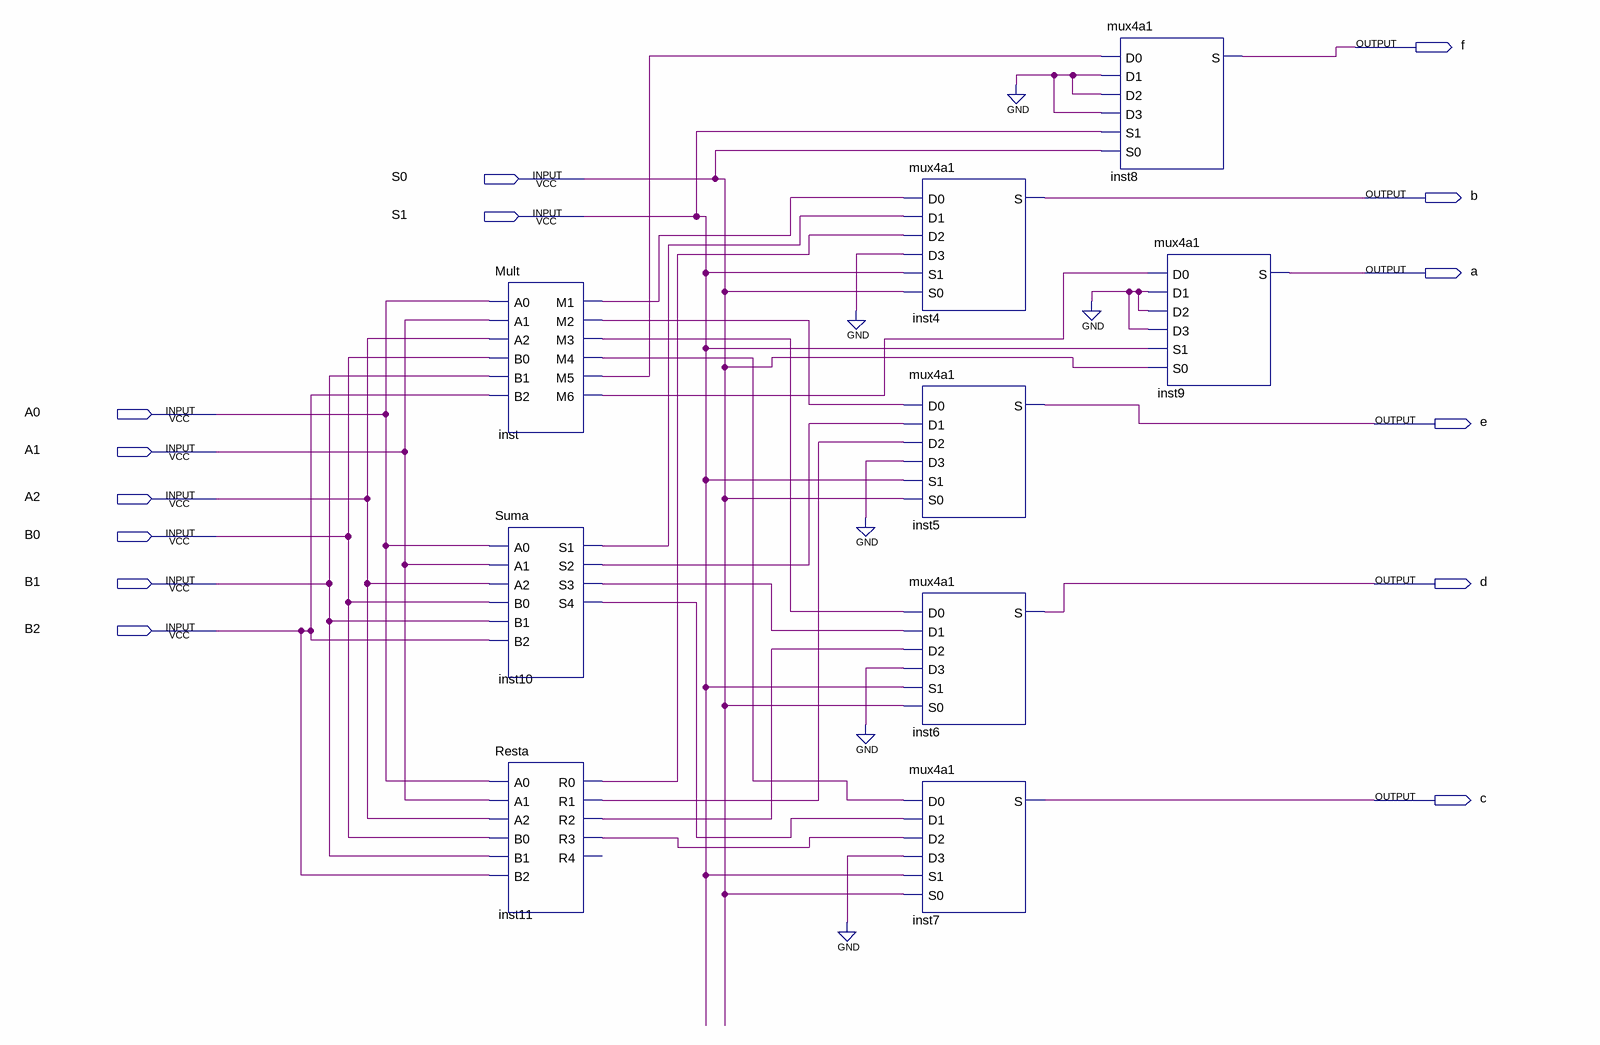
[diagram p0: schematic sheet]
// Quartus schematic Calculadora.bdf as structural Verilog: 9 symbols, 14 pins
module Calculadora (
  input  S0,
  input  S1,
  input  A0,
  input  A1,
  input  A2,
  input  B0,
  input  B1,
  input  B2,
  output f,
  output b,
  output a,
  output e,
  output d,
  output c
);

  wire inst10_s1, inst10_s2, inst10_s3, inst10_s4, inst11_r0, inst11_r1, inst11_r2, inst11_r3, inst_m1,
       inst_m2, inst_m3, inst_m4, inst_m5, inst_m6;

  Mult inst (
    .A0(A0), .A1(A1), .A2(A2), .B0(B0), .B1(B1), .B2(B2), .M1(inst_m1), .M2(inst_m2), .M3(inst_m3),
    .M4(inst_m4), .M5(inst_m5), .M6(inst_m6));
  Suma inst10 (
    .A0(A0), .A1(A1), .A2(A2), .B0(B0), .B1(B1), .B2(B2), .S1(inst10_s1), .S2(inst10_s2), .S3(inst10_s3),
    .S4(inst10_s4));
  Resta inst11 (
    .A0(A0), .A1(A1), .A2(A2), .B0(B0), .B1(B1), .B2(B2), .R0(inst11_r0), .R1(inst11_r1), .R2(inst11_r2),
    .R3(inst11_r3));  // open: R4
  mux4a1 inst4 (.D0(inst_m1), .D1(inst10_s1), .D2(inst11_r0), .D3(1'b0), .S1(S1), .S0(S0), .S(b));
  mux4a1 inst5 (.D0(inst_m2), .D1(inst10_s2), .D2(inst11_r1), .D3(1'b0), .S1(S1), .S0(S0), .S(e));
  mux4a1 inst6 (.D0(inst_m3), .D1(inst10_s3), .D2(inst11_r2), .D3(1'b0), .S1(S1), .S0(S0), .S(d));
  mux4a1 inst7 (.D0(inst_m4), .D1(inst10_s4), .D2(inst11_r3), .D3(1'b0), .S1(S1), .S0(S0), .S(c));
  mux4a1 inst8 (.D0(inst_m5), .D1(1'b0), .D2(1'b0), .D3(1'b0), .S1(S1), .S0(S0), .S(f));
  mux4a1 inst9 (.D0(inst_m6), .D1(1'b0), .D2(1'b0), .D3(1'b0), .S1(S1), .S0(S0), .S(a));
endmodule
